# Altium schematic sheet FEV-60_Motor_Driver_OnePhase.SchDoc
size B
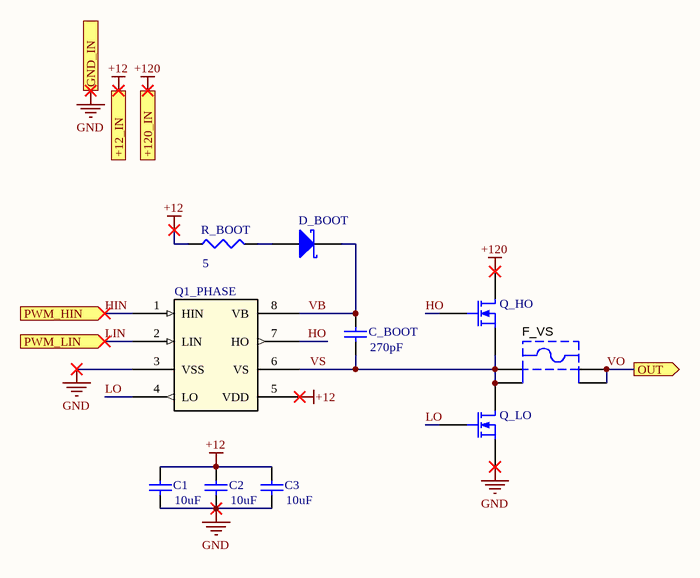
[diagram p0: FEV-60_Motor_Driver_OnePhase.SchDoc]

## Parts
C1  value 10uF  [1608[0603]]  (hidden comment: Cap Semi)
C2  value 10uF  [1608[0603]]  (hidden comment: Cap Semi)
C3  value 10uF  [1608[0603]]  (hidden comment: Cap Semi)
C_BOOT  value 270pF  [1608[0603]]  (hidden comment: Cap Semi)
D_BOOT  STPS2200U  [SMB]  (value not drawn)
F_VS  3568  [KSTN-3568_V]  (value not drawn)
Q1_PHASE  FAN7191-F085  [SOIC8]  (value not drawn)
Q_HO  TPH2900ENH  [TPH2900ENH]  (value not drawn)
Q_LO  TPH2900ENH  [TPH2900ENH]  (value not drawn)
R_BOOT  value 5  [J1-0603]  (hidden comment: Res3)

## Ports
+12_IN (in), +120_IN (in), GND_IN (in), OUT (out), PWM_HIN (in), PWM_LIN (in)

## Nets
+12: C1.1 C2.1 C3.1 Q1_PHASE.5(VDD) R_BOOT.1 ; port +12_IN
+120: Q_HO.1(D) ; port +120_IN
GND: C1.2 C2.2 C3.2 Q1_PHASE.3(VSS) Q_LO.3(S) ; port GND_IN
HIN: Q1_PHASE.1(HIN) ; port PWM_HIN
HO: Q1_PHASE.7(HO) Q_HO.2(G)
LIN: Q1_PHASE.2(LIN) ; port PWM_LIN
LO: Q1_PHASE.4(LO) Q_LO.2(G)
VB: C_BOOT.2 D_BOOT.2(K) Q1_PHASE.8(VB)
VO: F_VS.3 F_VS.4 ; port OUT
VS: C_BOOT.1 F_VS.1 F_VS.2 Q1_PHASE.6(VS) Q_HO.3(S) Q_LO.1(D)
NetD_BOOT_1: D_BOOT.1(A) R_BOOT.2

## Notes on the sheet
- Title
- Date:
- Revision:
- Number:
- Team Skytanic
- Sheet
- of
- Senior Design
- 2019/2020
- File:

## Library data of the parts
C1-C3 C_BOOT = Cap Semi: Capacitor (Semiconductor SIM Model); Published: 8-Jun-2000; LatestRevisionDate: 29-May-2009; LatestRevisionNote: IPC-7351 Footprint Added.; PackageReference: C1206; Publisher: Altium Limited; PackageDescription: Chip Capacitor
D_BOOT = D Schottky: Schottky Diode; Published: 8-Jun-2000; LatestRevisionDate: 17-Jul-2002; LatestRevisionNote: Re-released for DXP Platform.; PackageReference: SMB; Publisher: Altium Limited; PackageDescription: DO-214-AA/SMB; 2 C-Bend Leads; Body 5.3 x 3.6 mm, inc. leads (LxW); Code_JEDEC: DO-214-AA
F_VS = CMP-2000-05464-1: Fuse Holder, 20 A, 500 V, -50 to 145 degC, 4-Pin THD, RoHS; Manufacturer: Keystone; Package Reference: 3568; Datasheet Version: 04/2013; Datasheet URL: https://datasheet.ciiva.com/16294/m60-2p40-16294706.pdf; Manufacturer URL: http://www.keyelco.com/; Mounting Technology: ThroughHole; Package Description: 4-Pin Through Hole Device, Body 16 x 6.73 mm, Pitch 9.9 mm
Q1_PHASE = FAN7191-F085: 600 V / 4.5 A, High and Low / Side Automotive Gate / Driver IC; Manufacturer: On Semiconductor; ComponentLink1Description: Datasheet; ComponentLink1URL: https://www.onsemi.com/pub/Collateral/FAN7191_F085-D.PDF; Part Number: FAN7191-F085
Q_HO Q_LO = TPH2900ENH: N-Channel 200V 33A (Ta) 78W (Tc) Surface Mount 8-SOP Advance (5x5); Manufacturer: Toshiba; Part Number: TPH2900ENHL1QCT-ND; ComponentLink1Description: TPH2900ENH; ComponentLink1URL: https://www.digikey.com/product-detail/en/toshiba-semiconductor-and-storage/TPH2900ENHL1Q/TPH2900ENHL1QCT-ND/5456291
R_BOOT = Res3: Resistor; Published: 8-Jun-2000; LatestRevisionDate: 29-May-2009; LatestRevisionNote: IPC-7351 Footprint Added.; PackageReference: J1-0603; Publisher: Altium Limited; PackageDescription: Chip Resistor